# Altium schematic sheet fpga22-serdes-power.SchDoc
size Tabloid; SheetNumber: 51; SheetTotal: 71
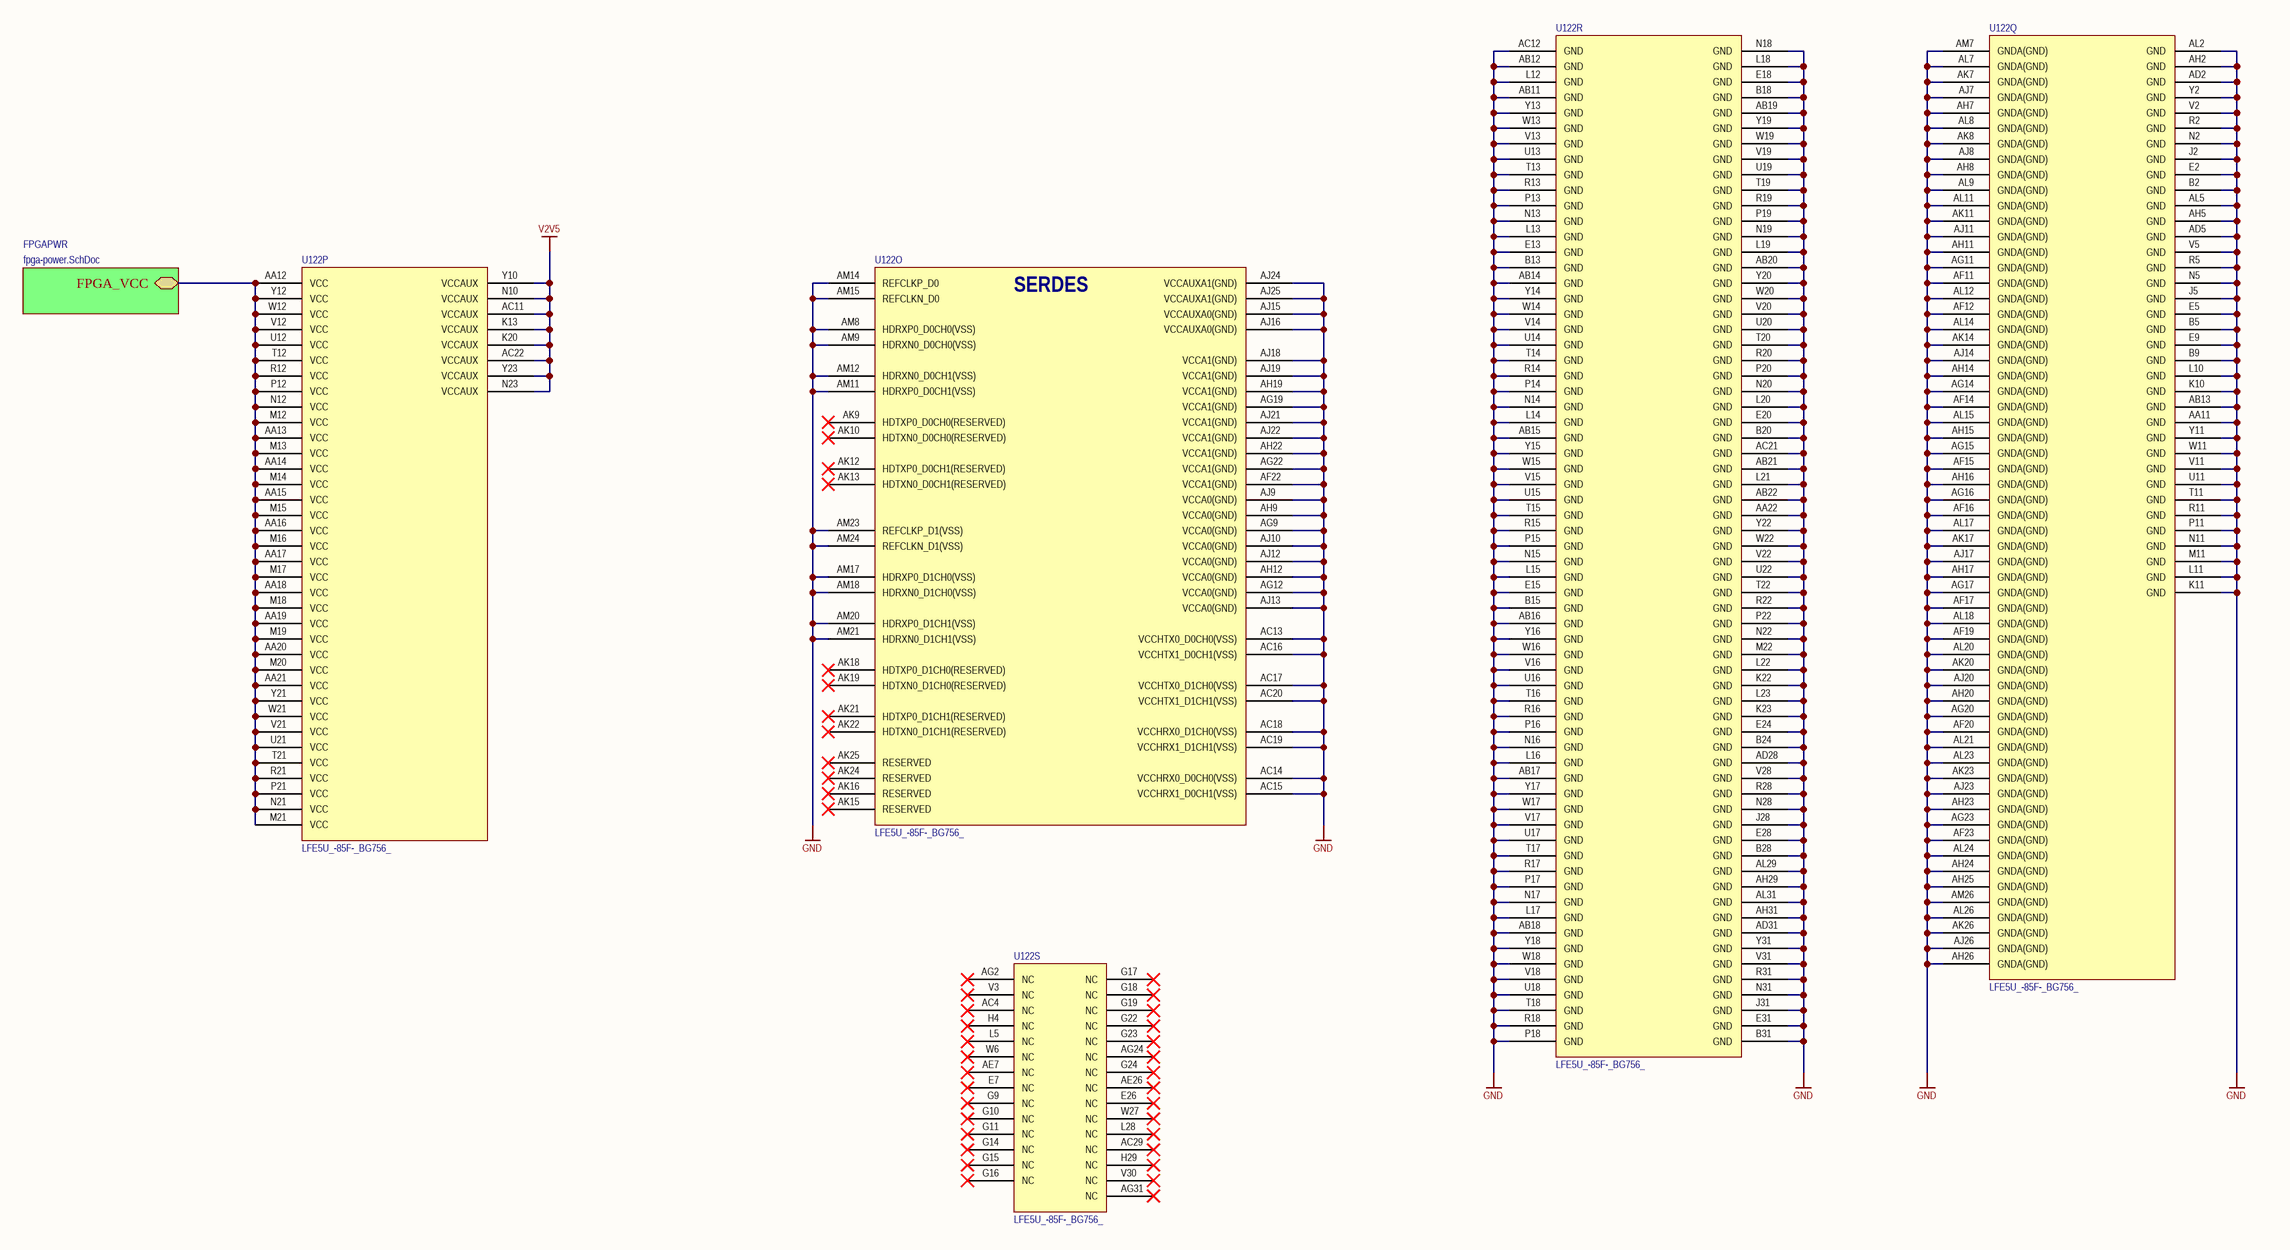
[diagram p0: fpga22-serdes-power.SchDoc]

## Parts
U122  LFE5U_-85F-_BG756_  [caBGA756]  (parts O,P,Q,R,S of 19)

## Sub-sheets
FPGAPWR = fpga-power.SchDoc: FPGA_VCC

## Nets
GND: U122.AA11(GND) U122.AA22(GND) U122.AB11(GND) U122.AB12(GND) U122.AB13(GND) U122.AB14(GND) U122.AB15(GND) U122.AB16(GND) U122.AB17(GND) U122.AB18(GND) U122.AB19(GND) U122.AB20(GND) U122.AB21(GND) U122.AB22(GND) U122.AC12(GND) U122.AC13(VCCHTX0_D0CH0(VSS)) U122.AC14(VCCHRX0_D0CH0(VSS)) U122.AC15(VCCHRX1_D0CH1(VSS)) U122.AC16(VCCHTX1_D0CH1(VSS)) U122.AC17(VCCHTX0_D1CH0(VSS)) U122.AC18(VCCHRX0_D1CH0(VSS)) U122.AC19(VCCHRX1_D1CH1(VSS)) U122.AC20(VCCHTX1_D1CH1(VSS)) U122.AC21(GND) U122.AD2(GND) U122.AD5(GND) U122.AD28(GND) U122.AD31(GND) U122.AF11(GNDA(GND)) U122.AF12(GNDA(GND)) U122.AF14(GNDA(GND)) U122.AF15(GNDA(GND)) U122.AF16(GNDA(GND)) U122.AF17(GNDA(GND)) U122.AF19(GNDA(GND)) U122.AF20(GNDA(GND)) U122.AF22(VCCA1(GND)) U122.AF23(GNDA(GND)) U122.AG9(VCCA0(GND)) U122.AG11(GNDA(GND)) U122.AG12(VCCA0(GND)) U122.AG14(GNDA(GND)) U122.AG15(GNDA(GND)) U122.AG16(GNDA(GND)) U122.AG17(GNDA(GND)) U122.AG19(VCCA1(GND)) U122.AG20(GNDA(GND)) U122.AG22(VCCA1(GND)) U122.AG23(GNDA(GND)) U122.AH2(GND) U122.AH5(GND) U122.AH7(GNDA(GND)) U122.AH8(GNDA(GND)) U122.AH9(VCCA0(GND)) U122.AH11(GNDA(GND)) U122.AH12(VCCA0(GND)) U122.AH14(GNDA(GND)) U122.AH15(GNDA(GND)) U122.AH16(GNDA(GND)) U122.AH17(GNDA(GND)) U122.AH19(VCCA1(GND)) U122.AH20(GNDA(GND)) U122.AH22(VCCA1(GND)) U122.AH23(GNDA(GND)) U122.AH24(GNDA(GND)) U122.AH25(GNDA(GND)) U122.AH26(GNDA(GND)) U122.AH29(GND) U122.AH31(GND) U122.AJ7(GNDA(GND)) U122.AJ8(GNDA(GND)) U122.AJ9(VCCA0(GND)) U122.AJ10(VCCA0(GND)) U122.AJ11(GNDA(GND)) U122.AJ12(VCCA0(GND)) U122.AJ13(VCCA0(GND)) U122.AJ14(GNDA(GND)) U122.AJ15(VCCAUXA0(GND)) U122.AJ16(VCCAUXA0(GND)) U122.AJ17(GNDA(GND)) U122.AJ18(VCCA1(GND)) U122.AJ19(VCCA1(GND)) U122.AJ20(GNDA(GND)) U122.AJ21(VCCA1(GND)) U122.AJ22(VCCA1(GND)) U122.AJ23(GNDA(GND)) U122.AJ24(VCCAUXA1(GND)) U122.AJ25(VCCAUXA1(GND)) U122.AJ26(GNDA(GND)) U122.AK7(GNDA(GND)) U122.AK8(GNDA(GND)) U122.AK11(GNDA(GND)) U122.AK14(GNDA(GND)) U122.AK17(GNDA(GND)) U122.AK20(GNDA(GND)) U122.AK23(GNDA(GND)) U122.AK26(GNDA(GND)) U122.AL2(GND) U122.AL5(GND) U122.AL7(GNDA(GND)) U122.AL8(GNDA(GND)) U122.AL9(GNDA(GND)) U122.AL11(GNDA(GND)) U122.AL12(GNDA(GND)) U122.AL14(GNDA(GND)) U122.AL15(GNDA(GND)) U122.AL17(GNDA(GND)) U122.AL18(GNDA(GND)) U122.AL20(GNDA(GND)) U122.AL21(GNDA(GND)) U122.AL23(GNDA(GND)) U122.AL24(GNDA(GND)) U122.AL26(GNDA(GND)) U122.AL29(GND) U122.AL31(GND) U122.AM7(GNDA(GND)) U122.AM8(HDRXP0_D0CH0(VSS)) U122.AM9(HDRXN0_D0CH0(VSS)) U122.AM11(HDRXP0_D0CH1(VSS)) U122.AM12(HDRXN0_D0CH1(VSS)) U122.AM14(REFCLKP_D0) U122.AM15(REFCLKN_D0) U122.AM17(HDRXP0_D1CH0(VSS)) U122.AM18(HDRXN0_D1CH0(VSS)) U122.AM20(HDRXP0_D1CH1(VSS)) U122.AM21(HDRXN0_D1CH1(VSS)) U122.AM23(REFCLKP_D1(VSS)) U122.AM24(REFCLKN_D1(VSS)) U122.AM26(GNDA(GND)) U122.B2(GND) U122.B5(GND) U122.B9(GND) U122.B13(GND) U122.B15(GND) U122.B18(GND) U122.B20(GND) U122.B24(GND) U122.B28(GND) U122.B31(GND) U122.E2(GND) U122.E5(GND) U122.E9(GND) U122.E13(GND) U122.E15(GND) U122.E18(GND) U122.E20(GND) U122.E24(GND) U122.E28(GND) U122.E31(GND) U122.J2(GND) U122.J5(GND) U122.J28(GND) U122.J31(GND) U122.K10(GND) U122.K11(GND) U122.K22(GND) U122.K23(GND) U122.L10(GND) U122.L11(GND) U122.L12(GND) U122.L13(GND) U122.L14(GND) U122.L15(GND) U122.L16(GND) U122.L17(GND) U122.L18(GND) U122.L19(GND) U122.L20(GND) U122.L21(GND) U122.L22(GND) U122.L23(GND) U122.M11(GND) U122.M22(GND) U122.N2(GND) U122.N5(GND) U122.N11(GND) U122.N13(GND) U122.N14(GND) U122.N15(GND) U122.N16(GND) U122.N17(GND) U122.N18(GND) U122.N19(GND) U122.N20(GND) U122.N22(GND) U122.N28(GND) U122.N31(GND) U122.P11(GND) U122.P13(GND) U122.P14(GND) U122.P15(GND) U122.P16(GND) U122.P17(GND) U122.P18(GND) U122.P19(GND) U122.P20(GND) U122.P22(GND) U122.R2(GND) U122.R5(GND) U122.R11(GND) U122.R13(GND) U122.R14(GND) U122.R15(GND) U122.R16(GND) U122.R17(GND) U122.R18(GND) U122.R19(GND) U122.R20(GND) U122.R22(GND) U122.R28(GND) U122.R31(GND) U122.T11(GND) U122.T13(GND) U122.T14(GND) U122.T15(GND) U122.T16(GND) U122.T17(GND) U122.T18(GND) U122.T19(GND) U122.T20(GND) U122.T22(GND) U122.U11(GND) U122.U13(GND) U122.U14(GND) U122.U15(GND) U122.U16(GND) U122.U17(GND) U122.U18(GND) U122.U19(GND) U122.U20(GND) U122.U22(GND) U122.V2(GND) U122.V5(GND) U122.V11(GND) U122.V13(GND) U122.V14(GND) U122.V15(GND) U122.V16(GND) U122.V17(GND) U122.V18(GND) U122.V19(GND) U122.V20(GND) U122.V22(GND) U122.V28(GND) U122.V31(GND) U122.W11(GND) U122.W13(GND) U122.W14(GND) U122.W15(GND) U122.W16(GND) U122.W17(GND) U122.W18(GND) U122.W19(GND) U122.W20(GND) U122.W22(GND) U122.Y2(GND) U122.Y11(GND) U122.Y13(GND) U122.Y14(GND) U122.Y15(GND) U122.Y16(GND) U122.Y17(GND) U122.Y18(GND) U122.Y19(GND) U122.Y20(GND) U122.Y22(GND) U122.Y31(GND)
V2V5: U122.AC11(VCCAUX) U122.AC22(VCCAUX) U122.K13(VCCAUX) U122.K20(VCCAUX) U122.N10(VCCAUX) U122.N23(VCCAUX) U122.Y10(VCCAUX) U122.Y23(VCCAUX)
NetU122_AA12: U122.AA12(VCC) U122.AA13(VCC) U122.AA14(VCC) U122.AA15(VCC) U122.AA16(VCC) U122.AA17(VCC) U122.AA18(VCC) U122.AA19(VCC) U122.AA20(VCC) U122.AA21(VCC) U122.M12(VCC) U122.M13(VCC) U122.M14(VCC) U122.M15(VCC) U122.M16(VCC) U122.M17(VCC) U122.M18(VCC) U122.M19(VCC) U122.M20(VCC) U122.M21(VCC) U122.N12(VCC) U122.N21(VCC) U122.P12(VCC) U122.P21(VCC) U122.R12(VCC) U122.R21(VCC) U122.T12(VCC) U122.T21(VCC) U122.U12(VCC) U122.U21(VCC) U122.V12(VCC) U122.V21(VCC) U122.W12(VCC) U122.W21(VCC) U122.Y12(VCC) U122.Y21(VCC) ; sheet FPGAPWR/FPGA_VCC

Not connected (* = marked no-connect by the designer): U122 AC4(NC)* AC29(NC)* AE7(NC)* AE26(NC)* AG2(NC)* AG24(NC)* AG31(NC)* AK9(HDTXP0_D0CH0(RESERVED))* AK10(HDTXN0_D0CH0(RESERVED))* AK12(HDTXP0_D0CH1(RESERVED))* AK13(HDTXN0_D0CH1(RESERVED))* AK15(RESERVED)* AK16(RESERVED)* AK18(HDTXP0_D1CH0(RESERVED))* AK19(HDTXN0_D1CH0(RESERVED))* AK21(HDTXP0_D1CH1(RESERVED))* AK22(HDTXN0_D1CH1(RESERVED))* AK24(RESERVED)* AK25(RESERVED)* E7(NC)* E26(NC)* G9(NC)* G10(NC)* G11(NC)* G14(NC)* G15(NC)* G16(NC)* G17(NC)* G18(NC)* G19(NC)* G22(NC)* G23(NC)* G24(NC)* H4(NC)* H29(NC)* L5(NC)* L28(NC)* V3(NC)* V30(NC)* W6(NC)* W27(NC)*

## Notes on the sheet
- (in symbol LFE5U_-85F-_BG756_, part O) SERDES

## Library data of the parts
U122 = LFE5U_-85F-_BG756_: ECP5 FPGA, 85k LUT, 756-caBGA; Manufacturer: Lattice Semiconductor; Manufacturer P/N: LFE5U_-85F-_BG756_